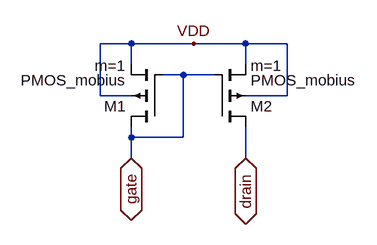
[diagram p0: schematic pMOS_currentMirror.asc]
pMOS_currentMirror.asc, the LTspice schematic file:
Version 4
SHEET 1 880 680
WIRE 336 160 288 160
WIRE 432 160 336 160
WIRE 512 160 432 160
WIRE 576 160 512 160
WIRE 336 192 336 160
WIRE 512 192 512 160
WIRE 416 208 384 208
WIRE 464 208 416 208
WIRE 288 240 288 160
WIRE 336 240 288 240
WIRE 576 240 576 160
WIRE 576 240 512 240
WIRE 336 304 336 288
WIRE 416 304 416 208
WIRE 416 304 336 304
WIRE 336 336 336 304
WIRE 512 336 512 288
FLAG 432 160 VDD
FLAG 336 336 gate
IOPIN 336 336 BiDir
FLAG 512 336 drain
IOPIN 512 336 BiDir
SYMBOL pmos4 384 288 R180
WINDOW 123 56 94 Left 2
SYMATTR Value2 m=1
SYMATTR InstName M1
SYMATTR Value PMOS_mobius
SYMATTR Prefix X
SYMBOL pmos4 464 288 M180
WINDOW 123 56 94 Left 2
SYMATTR Value2 m=1
SYMATTR InstName M2
SYMATTR Value PMOS_mobius
SYMATTR Prefix X

The netlist it stands for:
* pMOS_currentMirror.asc
XM1 gate gate VDD VDD PMOS_mobius m=1  ; pins D G S B
XM2 drain gate VDD VDD PMOS_mobius m=1  ; pins D G S B
.backanno
.end